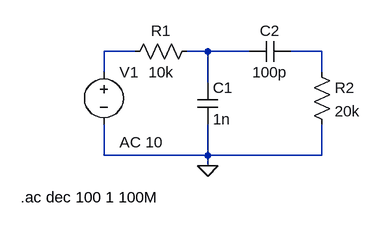
[diagram p0: schematic LTspiceIV_Vukasin_Paunovic_Filter.asc]
LTspiceIV_Vukasin_Paunovic_Filter.asc, the LTspice schematic file:
Version 4
SHEET 1 880 680
WIRE 112 64 64 64
WIRE 224 64 192 64
WIRE 288 64 224 64
WIRE 400 64 352 64
WIRE 64 96 64 64
WIRE 400 96 400 64
WIRE 224 112 224 64
WIRE 64 224 64 176
WIRE 224 224 224 176
WIRE 224 224 64 224
WIRE 400 224 400 176
WIRE 400 224 224 224
WIRE 224 240 224 224
FLAG 224 240 0
SYMBOL cap 208 112 R0
SYMATTR InstName C1
SYMATTR Value 1n
SYMBOL cap 288 80 R270
WINDOW 0 32 32 VTop 2
WINDOW 3 0 32 VBottom 2
SYMATTR InstName C2
SYMATTR Value 100p
SYMBOL voltage 64 80 R0
WINDOW 123 24 124 Left 2
WINDOW 39 0 0 Left 2
SYMATTR InstName V1
SYMATTR Value ""
SYMATTR Value2 AC 10
SYMBOL res 96 80 R270
WINDOW 0 32 56 VTop 2
WINDOW 3 0 56 VBottom 2
SYMATTR InstName R1
SYMATTR Value 10k
SYMBOL res 384 80 R0
SYMATTR InstName R2
SYMATTR Value 20k
TEXT -64 288 Left 2 !.ac dec 100 1 100M

The netlist it stands for:
* LTspiceIV_Vukasin_Paunovic_Filter.asc
C1 N002 0 1n
C2 N002 N003 100p
V1 N001 0 AC 10
R1 N001 N002 10k
R2 N003 0 20k
.ac dec 100 1 100M
.backanno
.end